# EAGLE design io (EAGLE 8.2.2)
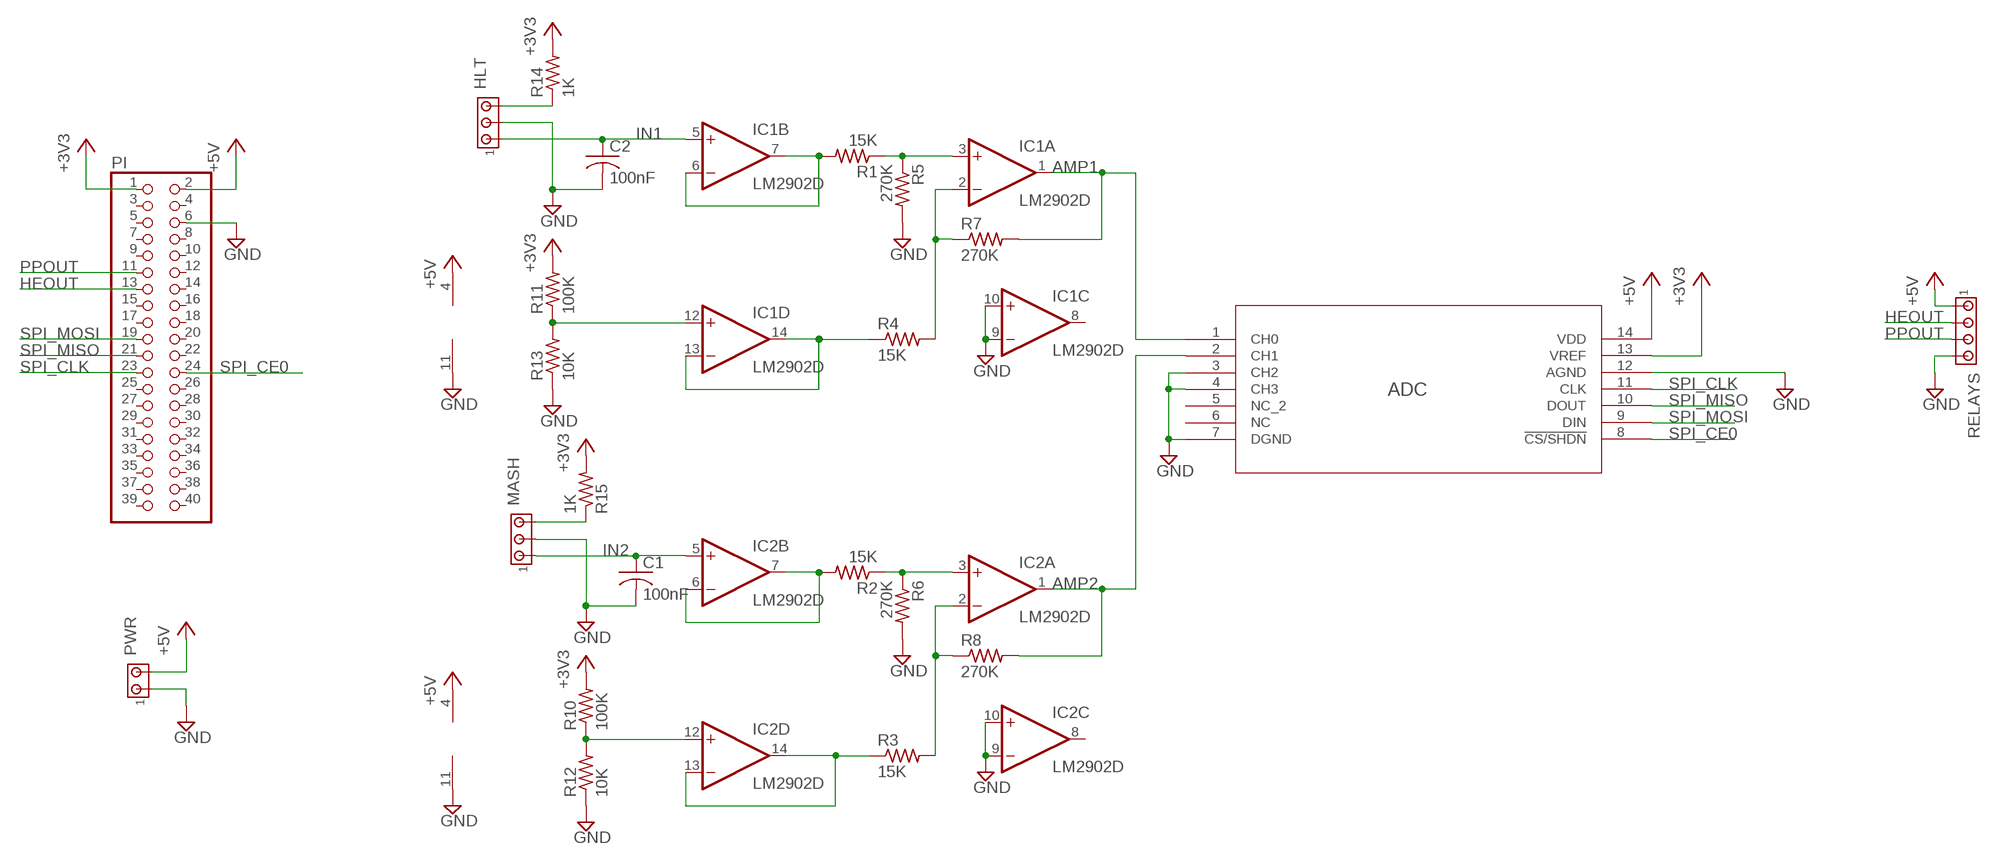
[diagram p0: schematic, sheet 1]

## Parts
ADC  MCP3004-I/SL  [SOIC14-N_MC]
C1  100nF  C-USC0402  [C0402]
C2  100nF  C-USC0402  [C0402]
HLT  MTA03-100  [10X03MTA]
IC1  LM2902D  [SO14]
IC2  LM2902D  [SO14]
MASH  MTA03-100  [10X03MTA]
PI  PINHD-2X20  [2X20]
PWR  MTA02-100  [10X02MTA]
R1  15K  R-US_R0402  [R0402]
R2  15K  R-US_R0402  [R0402]
R3  15K  R-US_R0402  [R0402]
R4  15K  R-US_R0402  [R0402]
R5  270K  R-US_R0402  [R0402]
R6  270K  R-US_R0402  [R0402]
R7  270K  R-US_R0402  [R0402]
R8  270K  R-US_R0402  [R0402]
R10  100K  R-US_R0402  [R0402]
R11  100K  R-US_R0402  [R0402]
R12  10K  R-US_R0402  [R0402]
R13  10K  R-US_R0402  [R0402]
R14  1K  R-US_R0402  [R0402]
R15  1K  R-US_R0402  [R0402]
RELAYS  MTA04-100  [10X04MTA]

## Nets
+3V3: ADC.13(VREF) PI.1 R10.2 R11.2 R14.2 R15.2
+5V: ADC.14(VDD) IC1.4(P:V+) IC2.4(P:V+) PI.2 PWR.2 RELAYS.1
AMP1: ADC.1(CH0) IC1.1(A:OUT) R7.2
AMP2: ADC.2(CH1) IC2.1(A:OUT) R8.2
GND: ADC.3(CH2) ADC.4(CH3) ADC.7(DGND) ADC.12(AGND) C1.2 C2.2 HLT.2 IC1.9(C:-IN) IC1.10(C:+IN) IC1.11(P:V-) IC2.9(C:-IN) IC2.10(C:+IN) IC2.11(P:V-) MASH.2 PI.6 R5.2 R6.2 R12.1 R13.1 RELAYS.4
HEOUT: PI.13 RELAYS.2
IN1: C2.1 HLT.1 IC1.5(B:+IN)
IN2: C1.1 IC2.5(B:+IN) MASH.1
N$1: IC1.6(B:-IN) IC1.7(B:OUT) R1.2
N$2: IC1.3(A:+IN) R1.1 R5.1
N$3: IC1.12(D:+IN) R11.1 R13.2
N$4: IC1.2(A:-IN) R4.2 R7.1
N$5: IC1.13(D:-IN) IC1.14(D:OUT) R4.1
N$6: IC2.6(B:-IN) IC2.7(B:OUT) R2.2
N$7: IC2.3(A:+IN) R2.1 R6.1
N$8: IC2.2(A:-IN) R3.2 R8.1
N$9: IC2.12(D:+IN) R10.1 R12.2
N$10: IC2.13(D:-IN) IC2.14(D:OUT) R3.1
N$11: MASH.3 R15.1
N$12: HLT.3 R14.1
PPOUT: PI.11 RELAYS.3
SPI_CE0: ADC.8(!CS/SHDN) PI.24
SPI_CLK: ADC.11(CLK) PI.23
SPI_MISO: ADC.10(DOUT) PI.21
SPI_MOSI: ADC.9(DIN) PI.19
Unconnected: ADC.5(NC_2) ADC.6(NC) IC1.8(C:OUT) IC2.8(C:OUT) PI.3 PI.4 PI.5 PI.7 PI.8 PI.9 PI.10 PI.12 PI.14 PI.15 PI.16 PI.17 PI.18 PI.20 PI.22 PI.25 PI.26 PI.27 PI.28 PI.29 PI.30 PI.31 PI.32 PI.33 PI.34 PI.35 PI.36 PI.37 PI.38 PI.39 PI.40 PWR.1

## Library data of the parts
ADC = digikey:MCP3004-I/SL; MANUFACTURER_PART_NUMBER: MCP3004ISL; VENDOR: Microchip
C1 C2 = resistor:C-US: CAPACITOR, American symbol
HLT MASH = con-amp:MTA03-100: AMP connector
IC1 IC2 = linear:LM2902: Low power quad operational amplifier Source: Data sgeet <http://www.st.com/internet/com/TECHNICAL_RESOURCES/TECHNICAL_LITERATURE/DATASHEET/CD00000533.pdf>
PI = adafruit:PINHD-2X20: PIN HEADER
PWR = con-amp:MTA02-100: AMP connector
R1-R8 R10 R11 = rcl:R-US_: RESISTOR, American symbol
R12-R15 = resistor:R-US_: RESISTOR, American symbol
RELAYS = con-amp:MTA04-100: AMP connector

## Net classes
1 5A_600V: width 0.762 mm, clearance 0.508 mm
2 30A_600V: width 7.62 mm, clearance 0.508 mm

## Board
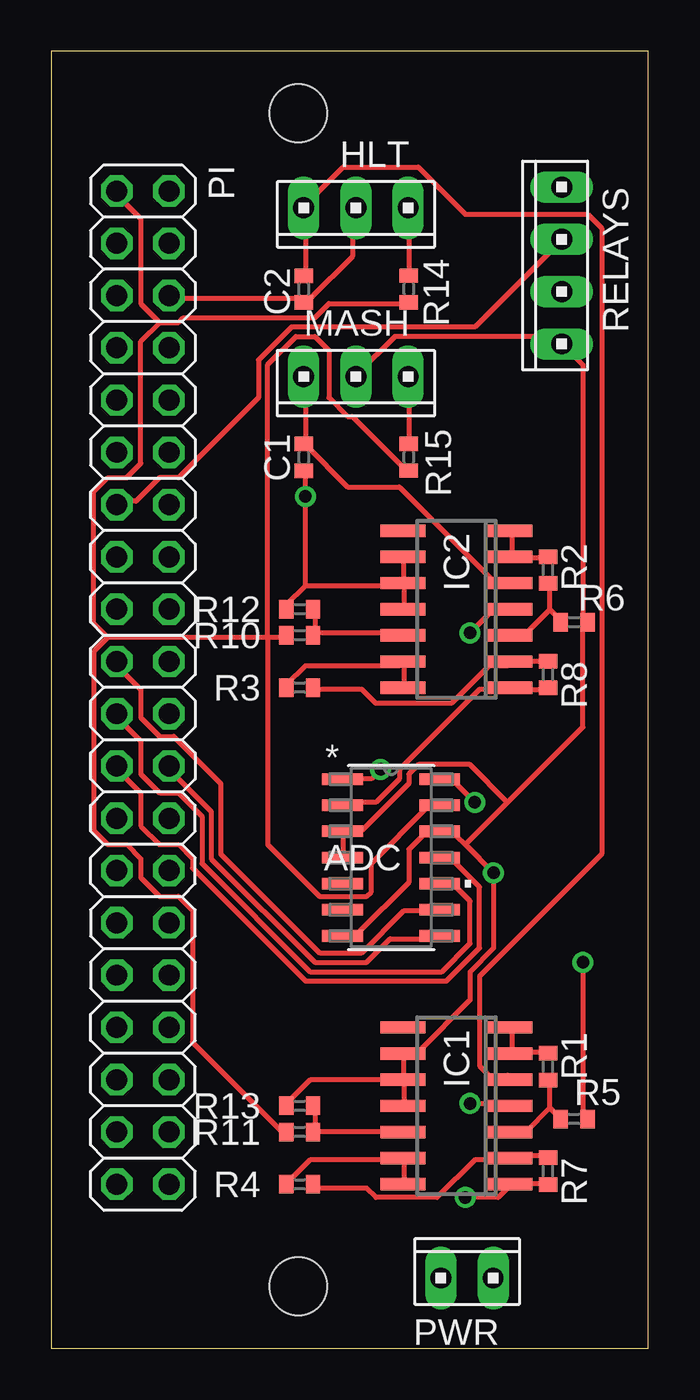
[diagram p1: board, top side]
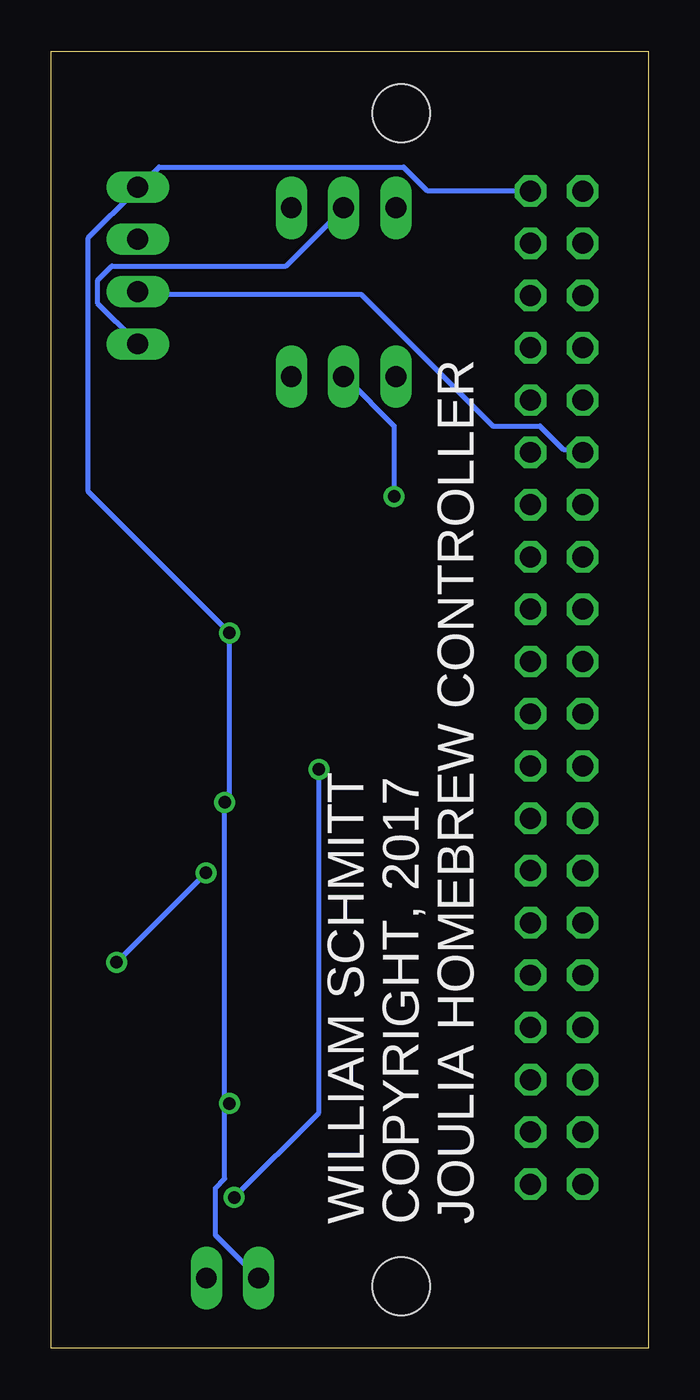
[diagram p2: board, bottom side, seen from below]

Size 29 x 63 mm. Coordinates in mm from the lower left corner, seen from the top.
Outline: 0,0 29,0 29,63 0,63 0,0
Copper layers (1*16): Top 0.035mm / dielectric 1.5mm / Bottom 0.035mm
Design rules "default": minimum track width 10mil, minimum drill 24mil, track to track 8mil, track to pad 8mil, pad to pad 8mil, via to via 8mil, smd to smd 8mil, copper to edge 40mil, drill to drill 8mil, minimum pad ring 10mil, minimum via ring 8mil, stop-mask expansion 4mil, vias tented up to drill 0mil, thermal gap 10mil
Holes 2.8 mm at 12,60 12,3

### Footprints (pad centres in the part's own frame; a part is rotated, then mirrored left to right if it is on the bottom)
SOIC14-N_MC = smd 1.981 x 0.559: 1 -2.362,3.81; 2 -2.362,2.54; 3 -2.362,1.27; 4 -2.362,0; 5 -2.362,-1.27; 6 -2.362,-2.54; 7 -2.362,-3.81; 8 2.362,-3.81; 9 2.362,-2.54; 10 2.362,-1.27; 11 2.362,0; 12 2.362,1.27; 13 2.362,2.54; 14 2.362,3.81
C0402 = smd 0.7 x 0.9: 1 -0.65,0; 2 0.65,0
10X03MTA = drill 1.016 long: 1 2.54,0; 2 0,0; 3 -2.54,0
SO14 = smd 0.6 x 2.2: 1 -3.81,-2.6; 2 -2.54,-2.6; 3 -1.27,-2.6; 4 0,-2.6; 5 1.27,-2.6; 6 2.54,-2.6; 7 3.81,-2.6; 8 3.81,2.6; 9 2.54,2.6; 10 1.27,2.6; 11 0,2.6; 12 -1.27,2.6; 13 -2.54,2.6; 14 -3.81,2.6
2X20 = drill 1.016 octagon: 1 -24.13,-1.27; 2 -24.13,1.27; 3 -21.59,-1.27; 4 -21.59,1.27; 5 -19.05,-1.27; 6 -19.05,1.27; 7 -16.51,-1.27; 8 -16.51,1.27; 9 -13.97,-1.27; 10 -13.97,1.27; 11 -11.43,-1.27; 12 -11.43,1.27; 13 -8.89,-1.27; 14 -8.89,1.27; 15 -6.35,-1.27; 16 -6.35,1.27; 17 -3.81,-1.27; 18 -3.81,1.27; 19 -1.27,-1.27; 20 -1.27,1.27; 21 1.27,-1.27; 22 1.27,1.27; 23 3.81,-1.27; 24 3.81,1.27; 25 6.35,-1.27; 26 6.35,1.27; 27 8.89,-1.27; 28 8.89,1.27; 29 11.43,-1.27; 30 11.43,1.27; 31 13.97,-1.27; 32 13.97,1.27; 33 16.51,-1.27; 34 16.51,1.27; 35 19.05,-1.27; 36 19.05,1.27; 37 21.59,-1.27; 38 21.59,1.27; 39 24.13,-1.27; 40 24.13,1.27
10X02MTA = drill 1.016 long: 1 1.27,0; 2 -1.27,0
R0402 = smd 0.7 x 0.9: 1 -0.65,0; 2 0.65,0
10X04MTA = drill 1.016 long: 1 3.81,0; 2 1.27,0; 3 -1.27,0; 4 -3.81,0

### Placement (x,y rotation side)
ADC  16.51,23.84 0 top
C1  12.27,43.28 270 top
C2  12.27,51.45 270 top
HLT  14.8,55.4 180 top
IC1  19.68,11.77 90 top
IC2  19.68,35.9 90 top
MASH  14.8,47.2 180 top
PI  4.45,32.09 270 top
PWR  20.2,3.4 0 top
R1  24.13,13.68 90 top
R2  24.13,37.8 90 top
R3  12.06,32.09 0 top
R4  12.06,7.96 0 top
R5  25.4,11.13 0 top
R6  25.4,35.27 0 top
R7  24.13,8.6 270 top
R8  24.13,32.73 270 top
R10  12.06,34.63 180 top
R11  12.06,10.5 180 top
R12  12.06,35.9 0 top
R13  12.06,11.77 0 top
R14  17.36,51.45 270 top
R15  17.36,43.28 270 top
RELAYS  24.8,52.6 90 top

### Tracks (layer width: path | path; a pad name or v marks a point on that pad's centre or on a via)
+3V3
  Top 0.254: 5.26,49.84 6.17,49.84 6.4,50.06 12.8,50.06 13.49,50.75 17.14,50.75 R14.2 | 5.26,49.84 4.34,50.75 4.34,54.86 3.2,56.01 PI.1 | 2.74,34.52 2.06,33.83 2.06,25.15 2.74,24.46 3.66,24.46 4.34,23.77 4.34,22.86 5.26,21.95 6.17,21.95 6.86,21.26 6.86,14.86 11.2,10.52 R11.2 | 10.52,34.52 11.2,34.52 R10.2 | 10.52,34.52 2.74,34.52 | 10.52,34.52 10.52,47.78 11.89,49.15 12.8,49.15 13.49,48.46 13.49,46.18 14.4,45.26 14.63,45.26 17.14,42.75 R15.2 | 10.52,34.52 10.52,24.46 13.03,21.95 15.32,21.95 15.54,22.17 15.54,23.55 18.29,26.29 18.75,26.29 ADC.13 | 5.26,49.84 4.34,48.92 4.34,42.98 3.66,42.29 2.74,42.29 2.06,41.6 2.06,35.2 2.74,34.52
+5V  (via drill 0.61)
  Top 0.254: v20.57,26.52 19.66,27.43 18.97,27.43 ADC.14 | v20.34,11.89 22.17,11.89 IC1.4 | v20.34,34.75 21.49,35.89 22.17,35.89 IC2.4
  Bottom 0.254: PI.2 5.71,56.24 10.74,56.24 11.89,57.38 23.77,57.38 24.69,56.46 RELAYS.1 24.92,56.24 27.2,53.95 27.2,41.6 v20.34,34.75 20.34,26.75 v20.57,26.52 20.57,11.89 | 20.57,11.89 20.57,8.23 21.03,7.77 21.03,5.49 18.97,3.43 PWR.2 | 20.57,11.89 v20.34,11.89
AMP1  (via drill 0.61)
  Top 0.254: R7.2 24,8 22.4,8 IC1.1 22.17,7.77 21.72,7.32 v20.12,7.32 | v16,28.12 15.54,27.66 14.17,27.66 ADC.1
  Bottom 0.254: v16,28.12 16,11.43 v20.12,7.32
AMP2
  Top 0.254: R8.2 24,32 22.4,32 IC2.1 22.17,32 20.8,32 16.92,28.12 16.92,27.66 15.77,26.52 14.17,26.52 ADC.2
GND  (via drill 0.61)
  Top 0.254: R13.1 11.43,11.89 12.57,13.03 16.92,13.03 IC1.10 | IC1.11 17.14,11.89 17.14,13.03 IC1.10 | IC1.10 17.14,13.26 17.14,14.17 IC1.9 17.14,14.4 17.83,14.4 20.34,16.92 20.34,18.29 21.49,19.43 v21.49,23.09 20.12,24.46 | ADC.4 14.17,24 14.17,24.92 ADC.3 14.17,25.15 15.09,25.15 17.37,27.43 17.37,27.89 17.83,28.35 20.34,28.35 22.17,26.52 | v25.83,18.75 25.83,11.2 R5.2 | 20.12,24.46 19.66,24.92 18.97,24.92 ADC.12 18.75,24.92 18.06,24.92 17.37,24.23 17.37,22.63 14.86,20.12 14.17,20.12 ADC.7 | 20.12,24.46 22.17,26.52 | 22.17,26.52 25.83,30.18 25.83,35.2 R6.2 25.83,35.43 25.83,47.78 24.92,48.69 RELAYS.4 24.69,48.92 24.46,49.15 16.69,49.15 14.86,47.32 MASH.2 | HLT.2 14.63,55.32 14.63,53.03 12.57,50.98 12.34,50.98 C2.2 12.12,50.98 5.71,50.98 PI.6 | 12.34,37.03 11.43,36.12 R12.1 | 12.34,37.03 16.92,37.03 IC2.10 | 12.34,37.03 v12.34,41.38 12.34,42.52 C1.2 | IC2.11 17.14,36.12 17.14,37.03 IC2.10 | IC2.9 17.14,38.41 17.14,37.26 IC2.10
  Bottom 0.254: v21.49,23.09 v25.83,18.75 | v12.34,41.38 12.34,44.81 14.63,47.09 MASH.2 | HLT.2 14.86,55.32 17.6,52.58 26.06,52.58 26.75,51.89 26.75,50.75 24.92,48.92 RELAYS.4
HEOUT
  Top 0.254: PI.13 3.2,41.15 4.12,41.15 5.26,42.29 6.17,42.29 10.06,46.18 10.06,48.01 11.66,49.61 20.57,49.61 24.69,53.72 RELAYS.2
IN1
  Top 0.254: C2.1 12.34,52.12 12.34,55.32 HLT.1 12.34,55.55 14.17,57.38 17.83,57.38 20.12,55.09 26.06,55.09 26.75,54.41 26.75,24 20.8,18.06 20.8,13.72 21.26,13.26 22.17,13.26 IC1.5
IN2
  Top 0.254: MASH.1 12.34,47.09 12.34,44.12 C1.1 12.34,43.89 14.4,41.83 16.92,41.83 21.49,37.26 22.17,37.26 IC2.5
N$1
  Top 0.254: 22.4,14.4 24,14.4 R1.2 | 22.4,14.4 22.4,15.54 IC1.7 | 22.4,14.4 IC1.6
N$2
  Top 0.254: 24.23,11.66 24.23,12.8 R1.1 | 24.23,11.66 24.69,11.2 R5.1 | 24.23,11.66 23.09,10.52 22.4,10.52 IC1.3
N$3
  Top 0.254: 12.8,10.52 12.8,11.66 R13.2 | 12.8,10.52 16.92,10.52 IC1.12 | 12.8,10.52 R11.1
N$4
  Top 0.254: R4.2 12.8,7.77 15.32,7.77 15.77,7.32 18.75,7.32 20.57,9.14 22.17,9.14 IC1.2 22.4,9.37 24,9.37 R7.1
N$5
  Top 0.254: R4.1 11.43,8 12.57,9.14 16.92,9.14 IC1.13 17.14,9.14 17.14,8 IC1.14
N$6
  Top 0.254: R2.2 24,38.41 22.4,38.41 IC2.6 22.4,38.63 22.4,39.55 IC2.7
N$7
  Top 0.254: 24.23,35.89 24.23,37.03 R2.1 | 24.23,35.89 24.69,35.43 R6.1 | 24.23,35.89 23.09,34.75 22.4,34.75 IC2.3
N$8
  Top 0.254: R3.2 12.8,32 15.09,32 15.77,31.32 19.43,31.32 21.26,33.15 22.17,33.15 IC2.2 22.4,33.38 24,33.38 R8.1
N$9
  Top 0.254: 12.8,34.75 12.8,35.89 R12.2 | 12.8,34.75 16.92,34.75 IC2.12 | 12.8,34.75 R10.1
N$10
  Top 0.254: R3.1 11.43,32.23 12.34,33.15 16.92,33.15 IC2.13 17.14,33.15 17.14,32.23 IC2.14
N$11
  Top 0.254: R15.1 17.37,44.12 17.37,47.09 MASH.3
N$12
  Top 0.254: R14.1 17.37,52.12 17.37,55.32 HLT.3
PPOUT
  Bottom 0.254: PI.11 3.2,43.66 4.12,43.66 5.26,44.81 7.54,44.81 13.95,51.21 24.69,51.21 RELAYS.3
SPI_CE0
  Top 0.254: ADC.8 18.75,19.89 16.46,19.89 15.32,18.75 12.8,18.75 7.77,23.77 7.77,26.06 5.71,28.12 PI.24
SPI_CLK
  Top 0.254: ADC.11 18.97,23.77 19.43,23.77 20.8,22.4 20.8,19.43 19.2,17.83 12.34,17.83 6.86,23.32 6.86,23.77 6.17,24.46 5.26,24.46 4.34,25.38 4.34,26.98 3.2,28.12 PI.23
SPI_MISO
  Top 0.254: ADC.10 18.97,22.4 19.66,22.4 20.34,21.72 20.34,19.66 18.97,18.29 12.57,18.29 7.32,23.55 7.32,25.83 6.17,26.98 5.26,26.98 4.34,27.89 4.34,29.49 3.2,30.63 PI.21
SPI_MOSI
  Top 0.254: ADC.9 18.75,21.26 17.14,21.26 15.09,19.2 13.03,19.2 8.23,24 8.23,27.43 5.94,29.72 5.26,29.72 4.34,30.63 4.34,32 3.2,33.15 PI.19

### Text on the board
bNames: JOULIA HOMEBREW CONTROLLER | WILLIAM SCHMITT / COPYRIGHT, 2017